# EAGLE design pcb-breakout-bt111 (EAGLE 7.5.0)
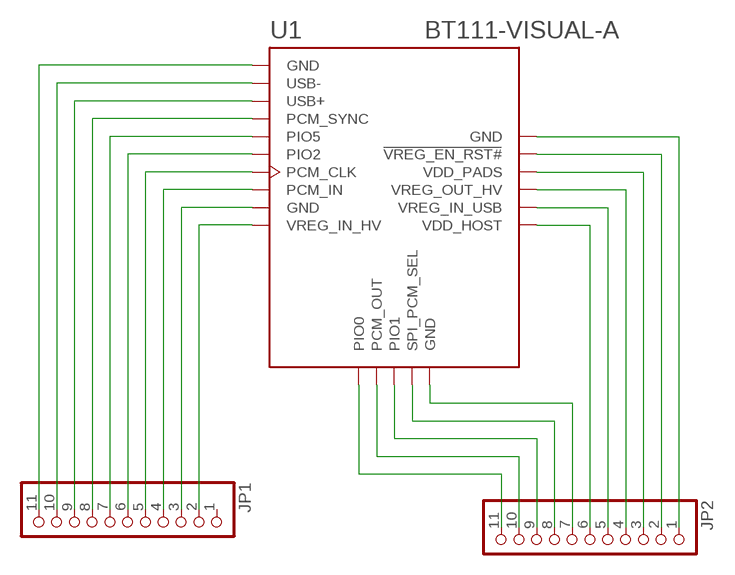
[diagram p0: schematic, sheet 1]

## Parts
JP1  PINHD-1X11  [1X11]
JP2  PINHD-1X11  [1X11]
U1  BT111-VISUAL-A  [BT111-A]

## Nets
N$1: JP1.11 U1.GND
N$2: JP1.10 U1.USB-
N$3: JP1.9 U1.USB+
N$4: JP2.1 U1.GND@4(GND)
N$5: JP2.2 U1.VREG_EN_RST#
N$6: JP2.3 U1.VDD_PADS
N$7: JP2.4 U1.VREG_OUT_HV
N$8: JP2.5 U1.VREG_IN_USB
N$9: JP2.6 U1.VDD_HOST
N$10: JP1.8 U1.PCM_SYNC
N$11: JP1.7 U1.PIO5
N$12: JP1.6 U1.PIO2
N$13: JP1.5 U1.PCM_CLK
N$14: JP1.4 U1.PCM_IN
N$15: JP1.3 U1.GND@2(GND)
N$16: JP1.2 U1.VREG_IN_HV
N$17: JP2.7 U1.GND@3(GND)
N$18: JP2.8 U1.SPI_PCM_SEL
N$19: JP2.9 U1.PIO1
N$20: JP2.10 U1.PCM_OUT
N$21: JP2.11 U1.PIO0
Unconnected: JP1.1

## Library data of the parts
JP1 JP2 = pinhead:PINHD-1X11: PIN HEADER
U1 = sf-bluegiga:BT111-VISUAL: Bluetooth Smart Ready (dual-mode) USB HCI module - Bluetooth 4.0. BT111-A variant has an on-module ceramic chip antenna. BT111-A variant includes keepout/restrict area. Antenna edge of the module should be flush up against the edge of the PCB. See datasheet for variant layout details. The BT111 is a low cost and ultra small Bluetooth Smart Ready HCI module designed for applications where both Bluetooth classic and Bluetooth low energy connectivity are needed. The BT111 integrates a Bluetooth 4.0 dual mode radio, HCI software stack, USB interface and an antenna. It is compatible with Windows and Linux operating systems and Microsoft and BlueZ Bluetooth stacks and offers OEMs a fast and risk-free way to integrate Bluetooth 4.0 connectivity into their applications. http://www.bluegiga.com/en-US/products/bluetooth-4.0-modules/bt111-bluetooth--smart-ready-hci https://github.com/jrowberg/sf-oshw Last updated 2014-01-04 by Jeff Rowberg <jeff@rowberg.net>

## Board
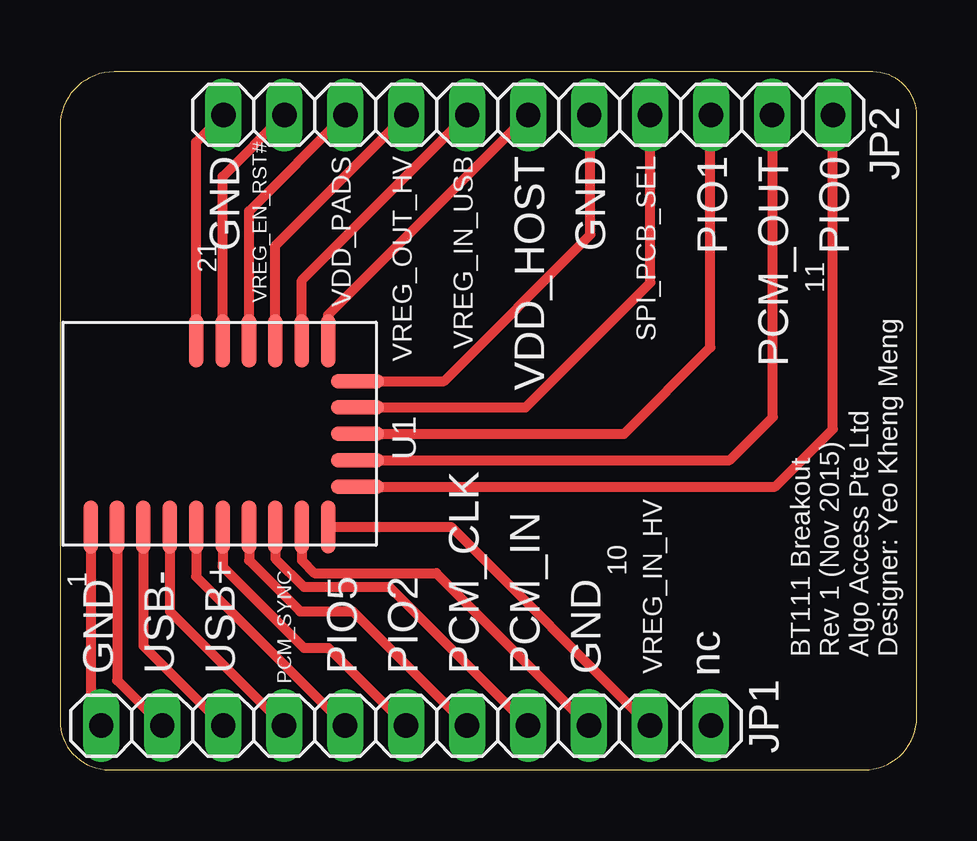
[diagram p1: board, top side]

Size 35.7 x 29.08 mm. Coordinates in mm from the lower left corner, seen from the top.
Outline: 0,26.83 0,2.05 arc90 2.05,0 33.51,0 arc90 35.7,2.19 35.7,27.25 arc90 33.87,29.08 2.25,29.08 arc90 0,26.83
Copper layers (1*16): Top 0.035mm / dielectric 1.5mm / Bottom 0.035mm
Design rules "Elecrow_2-layer_eagle_rule": minimum track width 6mil, minimum drill 12mil, track to track 6mil, track to pad 6mil, pad to pad 6mil, via to via 6mil, smd to smd 0mil, copper to edge 10mil, drill to drill 10mil, minimum pad ring 10mil, minimum via ring 6mil, stop-mask expansion 2mil, vias tented up to drill 100mil, thermal gap 10mil

### Footprints (pad centres in the part's own frame; a part is rotated, then mirrored left to right if it is on the bottom)
1X11 = drill 1.016 long: 1 -12.7,0; 2 -10.16,0; 3 -7.62,0; 4 -5.08,0; 5 -2.54,0; 6 0,0; 7 2.54,0; 8 5.08,0; 9 7.62,0; 10 10.16,0; 11 12.7,0
BT111-A = smd 2.2 x 0.6: GND -3.875,5.375; GND@2 -3.875,-3.425; GND@4 3.875,0.975; PCM_CLK -3.875,-1.225; PCM_IN -3.875,-2.325; PCM_SYNC -3.875,2.075; PIO2 -3.875,-0.125; PIO5 -3.875,0.975; USB+ -3.875,3.175; USB- -3.875,4.275; VDD_HOST 3.875,-4.525; VDD_PADS 3.875,-1.225; VREG_EN_RST# 3.875,-0.125; VREG_IN_HV -3.875,-4.525; VREG_IN_USB 3.875,-3.425; VREG_OUT_HV 3.875,-2.325 | smd 0.6 x 2.2: GND@3 2.2,-5.75; PCM_OUT -1.1,-5.75; PIO0 -2.2,-5.75; PIO1 0,-5.75; SPI_PCM_SEL 1.1,-5.75

### Placement (x,y rotation side)
JP1  14.42,1.84 180 top
JP2  19.51,27.29 0 top
U1  6.65,14 90 top

### Tracks (layer width: path | path; a pad name or v marks a point on that pad's centre or on a via)
N$1
  Top 0.406: U1.GND 1.27,2.29 JP1.11
N$2
  Top 0.406: U1.USB- 2.38,3.73 JP1.10
N$3
  Top 0.406: U1.USB+ 3.48,5.17 JP1.9
N$4
  Top 0.406: U1.GND@4 5.67,26.16 JP2.1
N$5
  Top 0.406: U1.VREG_EN_RST# 6.78,24.71 JP2.2
N$6
  Top 0.406: U1.VDD_PADS 7.88,23.27 JP2.3
N$7
  Top 0.406: U1.VREG_OUT_HV 8.97,21.84 JP2.4
N$8
  Top 0.406: U1.VREG_IN_USB 10.07,20.39 JP2.5
N$9
  Top 0.406: U1.VDD_HOST 11.18,18.95 JP2.6
N$10
  Top 0.406: U1.PCM_SYNC 4.58,6.61 JP1.8
N$11
  Top 0.406: U1.PIO5 5.67,8.04 JP1.7
N$12
  Top 0.406: U1.PIO2 6.78,8.46 10.16,5.08 11.18,5.08 JP1.6
N$13
  Top 0.406: U1.PCM_CLK 7.88,8.72 10,6.6 12.2,6.6 JP1.5
N$14
  Top 0.406: U1.PCM_IN 8.97,8.8 10.16,7.62 13.72,7.62 JP1.4
N$15
  Top 0.406: U1.GND@2 10.07,8.72 10.6,8.2 15.68,8.2 JP1.3
N$16
  Top 0.406: U1.VREG_IN_HV 16.3,10.12 JP1.2
N$17
  Top 0.406: U1.GND@3 16,16.2 22.1,22.3 22.1,27.04 JP2.7
N$18
  Top 0.406: U1.SPI_PCM_SEL 19.4,15.1 24.6,20.3 JP2.8
N$19
  Top 0.406: U1.PIO1 23.5,14 27.1,17.6 27.1,27.26 JP2.9
N$20
  Top 0.406: U1.PCM_OUT 27.9,12.9 29.7,14.7 29.7,27.26 JP2.10
N$21
  Top 0.406: U1.PIO0 29.8,11.8 32.2,14.2 JP2.11

### Text on the board
tPlace: GND | VREG_EN_RST# | VDD_PADS | VREG_OUT_HV | VREG_IN_USB | VDD_HOST | GND | SPI_PCB_SEL | PIO1 | PCM_OUT | PIO0 | 21 | 11 | 1 | 10 | BT111 Breakout / Rev 1 (Nov 2015) / Algo Access Pte Ltd / Designer: Yeo Kheng Meng | GND | USB- | USB+ | PCM_SYNC | PIO5 | PIO2 | PCM_CLK | PCM_IN | GND | VREG_IN_HV | nc